# Altium schematic sheet ST_LINK_V2.SCHDOC
size A4; DocumentNumber: 2; Revision: C.01; SheetNumber: 2; SheetTotal: 7
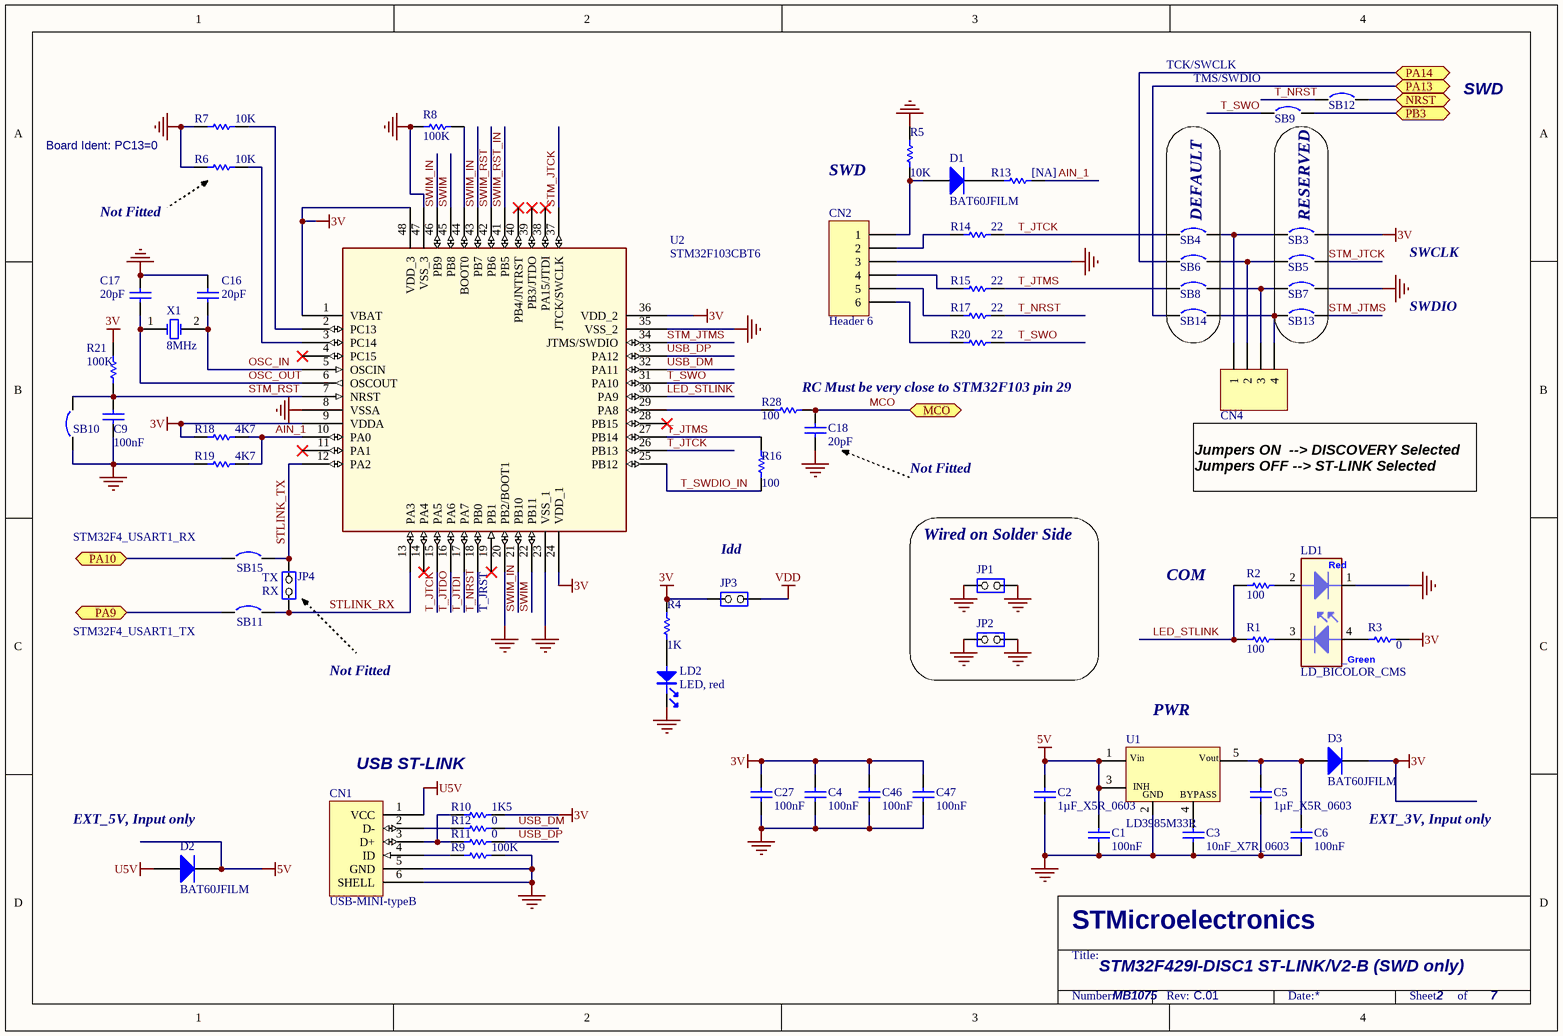
[diagram p0: ST_LINK_V2.SCHDOC]

## Parts
C1  100nF  [0402C]
C2  1µF_X5R_0603  [0603C]
C3  10nF_X7R_0603  [0603C]
C4  100nF  [0402C]
C5  1µF_X5R_0603  [0603C]
C6  100nF  [0402C]
C9  100nF  [0402C]
C16  20pF  [0402C]
C17  20pF  [0402C]
C18  20pF  [0402C]
C27  100nF  [0402C]
C46  100nF  [0402C]
C47  100nF  [0402C]
CN1  USB-MINI-typeB  [USB-MINI-B-SMD]
CN2  Header 6  [HDR1X6]
CN4  Header 4  [Header 4]  (value not drawn)
D1  BAT60JFILM  [SOD323/A]
D2  BAT60JFILM  [SOD323/A]
D3  BAT60JFILM  [SOD323/A]
JP1  (no value)  [SIP2/2.54]
JP2  (no value)  [SIP2/2.54]
JP3  (no value)  [SIP2/2.54]
JP4  JP2  [SIP2/2.54]  (value not drawn)
LD1  LD_BICOLOR_CMS  [HSMF-A201]
LD2  LED, red  [0603D]
R1  100  [0402R]
R2  100  [0402R]
R3  0  [0402R]
R4  1K  [0402R]
R5  10K  [0402R]
R6  10K  [0402R]
R7  10K  [0402R]
R8  100K  [0402R]
R9  100K  [0402R]
R10  1K5  [0402R]
R11  0  [0402R]
R12  0  [0402R]
R13  [NA]  [0402R]
R14  22  [0402R]
R15  22  [0402R]
R16  100  [0402R]
R17  22  [0402R]
R18  4K7  [0402R]
R19  4K7  [0402R]
R20  22  [0402R]
R21  100K  [0402R]
R28  100  [0402R]
SB3  Circuit Breaker  [JP2_SMD]  (value not drawn)
SB4  Circuit Breaker  [JP2_SMD]  (value not drawn)
SB5  Circuit Breaker  [JP2_SMD]  (value not drawn)
SB6  Circuit Breaker  [JP2_SMD]  (value not drawn)
SB7  Circuit Breaker  [JP2_SMD]  (value not drawn)
SB8  Circuit Breaker  [JP2_SMD]  (value not drawn)
SB9  Circuit Breaker  [JP2_SMD]  (value not drawn)
SB10  Circuit Breaker  [JP2_SMD]  (value not drawn)
SB11  Circuit Breaker  [JP2_SMD]  (value not drawn)
SB12  Circuit Breaker  [JP2_SMD]  (value not drawn)
SB13  Circuit Breaker  [JP2_SMD]  (value not drawn)
SB14  Circuit Breaker  [JP2_SMD]  (value not drawn)
SB15  Circuit Breaker  [JP2_SMD]  (value not drawn)
U1  LD3985M33R  [SOT-23-5L]
U2  STM32F103CBT6  [QFP48 7x7]
X1  8MHz  [XTAL1]

## Blocks framed on the sheet
DEFAULT: SB4 SB6 SB8 SB14
RESERVED: SB3 SB5 SB7 SB13
Wired on Solder Side: JP1 JP2

## Ports
MCO, NRST, PA9, PA10, PA13, PA14, PB3

## Nets
3V: C4.2 C27.2 C46.2 C47.2 D3.2(K) JP3.1(COMMON) R3.2 R4.2 R10.2 R18.1 R21.2 SB3.2 U2.1(VBAT) U2.9(VDDA) U2.24(VDD_1) U2.36(VDD_2) U2.48(VDD_3)
5V: C1.2 C2.2 D2.2(K) U1.1(Vin) U1.3(CE)
GND: C1.1 C2.1 C3.1 C4.1 C5.2 C6.1 C9.1 C16.2 C17.2 C18.1 C27.1 C46.1 C47.1 CN1.5(GND) CN1.6(SHELL) CN2.3 JP1.1(COMMON) JP1.2(NO) JP2.1(COMMON) JP2.2(NO) LD1.1 LD2.2 R5.2 R6.1 R7.1 R8.1 R9.2 R19.1 SB7.2 SB10.1 U1.2(GND) U2.8(VSSA) U2.20(PB2/BOOT1) U2.23(VSS_1) U2.35(VSS_2) U2.47(VSS_3)
U5V: CN1.1(VCC) D2.1(A)
VDD: JP3.2(NO)
AIN_1: R13.2 R18.2 R19.2 U2.10(PA0)
LED_STLINK: R1.1 R2.1 U2.30(PA9)
MCO: C18.2 R28.2 ; port MCO
NRST: SB12.2 ; port NRST
OSC_IN: C16.1 U2.5(OSCIN) X1.2(OSC2)
OSC_OUT: C17.1 U2.6(OSCOUT) X1.1(OSC1)
PA9: SB11.1 ; port PA9
PA10: SB15.1 ; port PA10
PA13: SB14.1 ; port PA13
PA14: SB6.1 ; port PA14
PB3: SB9.2 ; port PB3
STLINK_RX: JP4.1(COMMON) SB11.2 U2.13(PA3)
STLINK_TX: JP4.2(NO) SB15.2 U2.12(PA2)
STM_JTCK: SB5.2 U2.37(JTCK/SWCLK)
STM_JTMS: SB13.2 U2.34(JTMS/SWDIO)
STM_RST: C9.2 R21.1 SB10.2 U2.7(NRST)
SWIM: U2.22(PB11) U2.45(PB8)
SWIM_IN: U2.21(PB10) U2.43(PB7) U2.46(PB9)
SWIM_RST: U2.42(PB6)
SWIM_RST_IN: U2.41(PB5)
T_JTCK: R14.2 SB4.1 U2.15(PA5) U2.26(PB13)
T_JTDI: U2.17(PA7)
T_JTDO: U2.16(PA6)
T_JTMS: R15.2 R16.2 SB8.1 U2.27(PB14)
T_NRST: R17.2 SB12.1 U2.18(PB0)
T_SWDIO_IN: R16.1 U2.25(PB12)
T_SWO: R20.2 SB9.1 U2.31(PA10)
USB_DM: R12.2 U2.32(PA11)
USB_DP: R11.2 U2.33(PA12)
NetC3_2: C3.2 U1.4(BYPASS)
NetC5_1: C5.1 C6.2 D3.1(A) U1.5(Vout)
NetCN1_2: CN1.2(D-) R12.1
NetCN1_3: CN1.3(D+) R10.1 R11.1
NetCN1_4: CN1.4(ID) R9.1
NetCN2_1: CN2.1 D1.1(A) R5.1
NetCN2_2: CN2.2 R14.1
NetCN2_4: CN2.4 R15.1
NetCN2_5: CN2.5 R17.1
NetCN2_6: CN2.6 R20.1
NetCN4_1: CN4.1 SB3.1 SB4.2
NetCN4_2: CN4.2 SB5.1 SB6.2
NetCN4_3: CN4.3 SB7.1 SB8.2
NetCN4_4: CN4.4 SB13.1 SB14.2
NetD1_2: D1.2(K) R13.1
NetLD1_2: LD1.2 R2.2
NetLD1_3: LD1.3 R1.2
NetLD1_4: LD1.4 R3.1
NetLD2_1: LD2.1 R4.1
NetR6_2: R6.2 U2.3(PC14)
NetR7_2: R7.2 U2.2(PC13)
NetR8_2: R8.2 U2.44(BOOT0)
NetR28_1: R28.1 U2.29(PA8)

Not connected (* = marked no-connect by the designer): U2 4(PC15)* 11(PA1)* 14(PA4)* 19(PB1)* 28(PB15)* 38(PA15/JTDI)* 39(PB3/JTDO)* 40(PB4/JNTRST)*

## Notes on the sheet
- TCK/SWCLK
- (near SB9) TMS/SWDIO
- SWD
- Board Ident: PC13=0
- Not Fitted
- SWCLK
- SWDIO
- (near R28) RC Must be very close to STM32F103 pin 29
- Jumpers ON  --> DISCOVERY Selected
  Jumpers OFF --> ST-LINK Selected
- STM32F4_USART1_RX
- TX
- (near JP3) Idd
- COM
- STM32F4_USART1_TX
- RX
- (near U2) T_JRST
- (near U1) PWR
- USB ST-LINK
- (near D2) EXT_5V, Input only
- EXT_3V, Input only
- STM32F429I-DISC1 ST-LINK/V2-B (SWD only)
- MB1075
- STMicroelectronics
- Title:
- Number:
- Rev:
- Date:
- Sheet       of
- (in symbol LD3985M33R) INH
- (in symbol LD_BICOLOR_CMS) Red; _Green

## Library data of the parts
C1 C4 C6 C9 C27 C46 C47 = Capacitor_ST: Capacitor 0402 / 0603 / 0805; Revision: July-2002: Re-released for DXP Platform.; Value: 100nF
C2 C5 = CAP SMD 0603  X5R 1µF 25V 10%: 0603  X5R 1µF; Rated voltage: 25V; Tolerance: 10%; Manufacturer: *; Manufacturer P/N: *; Order code Farnell: 1288202RL; Value: 1µF; Power: *; Technology: X5R; Temperature  Factor: *; Temperature Max: +125°C; Temperature Min: -55°C; STS Code: *
C3 = CAP SMD 0603  X7R 10000PF 50V 10%: 0603  X7R 10NF; Order code RS: 2040779; Rated voltage: 50V; Tolerance: 10%; Order code Farnell: 7569548RL; Value: 10NF; Power: *; Technology: X7R; Temperature Factor: *; Temperature Min: -55°C; Temperature Max: +125°C; STS Code: *
C16 C17 = Capacitor_ST: Capacitor 0402 / 0603 / 0805; Value: 100nF; Revision: July-2002: Re-released for DXP Platform.
C18 = Capacitor_ST: Capacitor 0402 / 0603 / 0805; Value: 100nF; Fitted: NO; Revision: July-2002: Re-released for DXP Platform.
CN1 = USB-MINI-typeB connector: Manuf_Part_1: 5075BMR-05-SM; Manuf_Part_2: 218205M1110T; Manuf_2: lyconn; Description: USB,MINI-USB-5P/F, 5075BMR-05-M; Order: 5075BMR-05-SM
CN2 = Header 6: Header, 6-Pin; LatestRevisionDate: 17-Jul-2002; LatestRevisionNote: Re-released for DXP Platform.; Publisher: Altium Limited
CN4 = Header 4: Header, 4-Pin; Revision: 17-Jul-2002: Re-released for DXP Platform.; Publisher: Altium Limited
D1-D3 = BAT60JFILM: Manuf_1: STM; Provided: ST; ECCN_US/EU: EAR99/NEC; Revision: July-2002: Re-released for DXP Platform.; Order: BAT60JFILM; Manuf_Part_1: BAT60JFILM; Distrib: ST
JP1-JP3 = JP2
JP4 = JP2: Fitted: NO
LD1 = LD_BICOLOR_CMS: Bicolor Led; Manuf_Part_1: HSMF-A201-A00J1; Manuf_1: Avago Technologies; Manuf_2: everluck; Manuf_Part_2: LE-RGW35280; Ref St: xxxxxx; Distrib: RADIOSPARES
LD2 = LED_red: LED, red, 0603; Manuf_1: everlight; Manuf_Part_1: 19-213-R6C-AP1Q2B/3T; Description: LED,red,0603,19-213-R6C-AP1Q2B/3T,everlight; Order: 19-213-R6C-AP1Q2B/3T
R1-R4 R8-R12 R14-R21 R28 = Resistor_ST: Resistor 0402 / 0603 / 0805; Description: Resistor 0402 or 0603 or 0805; Value: 10K
R5 R7 = Resistor_ST: Resistor 0402 / 0603 / 0805; Description: Resistor 0402 or 0603 or 0805; Value: 10K
R6 = Resistor_ST: Resistor 0402 / 0603 / 0805; Description: Resistor 0402 or 0603 or 0805; Fitted: NO; Value: 10K
R13 = Resistor_ST: Resistor 0402 / 0603 / 0805; Description: Resistor 0402 or 0603 or 0805; Value: 10K; Fitted: NO
SB3 SB5 SB7 SB11-SB13 SB15 = Circuit Breaker: Solder: YES; Published: 24-Mar-1999; Revision: July-2002: Re-released for DXP Platform.; Publisher: Altium Limited
SB4 SB6 SB8-SB10 SB14 = Circuit Breaker: Solder: NO; Published: 24-Mar-1999; Revision: July-2002: Re-released for DXP Platform.; Publisher: Altium Limited
U1 = LD3985M33R: Ultra low drop-low noise BiCMOS voltage, regulators low ESR capacitors compatible; Manuf_1: STM; Provided: ST; Ref St: 9176161; ECCN_US/EU: EAR99/NEC; Manuf_Part_1: LD3985M33R; Distrib: ST; Order: LD3985M33R
U2 = STM32F103CBT6: Medium-density performance line ARM-based 32-bit MCU with 128KB Flash; Manuf_1: STM; Ref St: xxxxxxxx; Provided: ST; ECCN_US/EU: 3A991A2/NEC; Footprint: QFP48 7X7; Manuf_Part_1: STM32F103CBT6; Order: STM32F103CBT6; Distrib: ST
X1 = XTAL: Crystal Oscillator,8Mhz,20PF,20PPM,-10-70 degree,DIP,HC-49S; Manuf_Part_1: 9SL8000020AFXHF0; Order: 9SL8000020AFXHF0